# EasyEDA schematic Sheet_1.json
TITLE: Sheet_1; REV: 1.0; Date: 2025-05-11; Sheet: 1/1; Drawn By: ahmadputracahyo; Company: Your Company
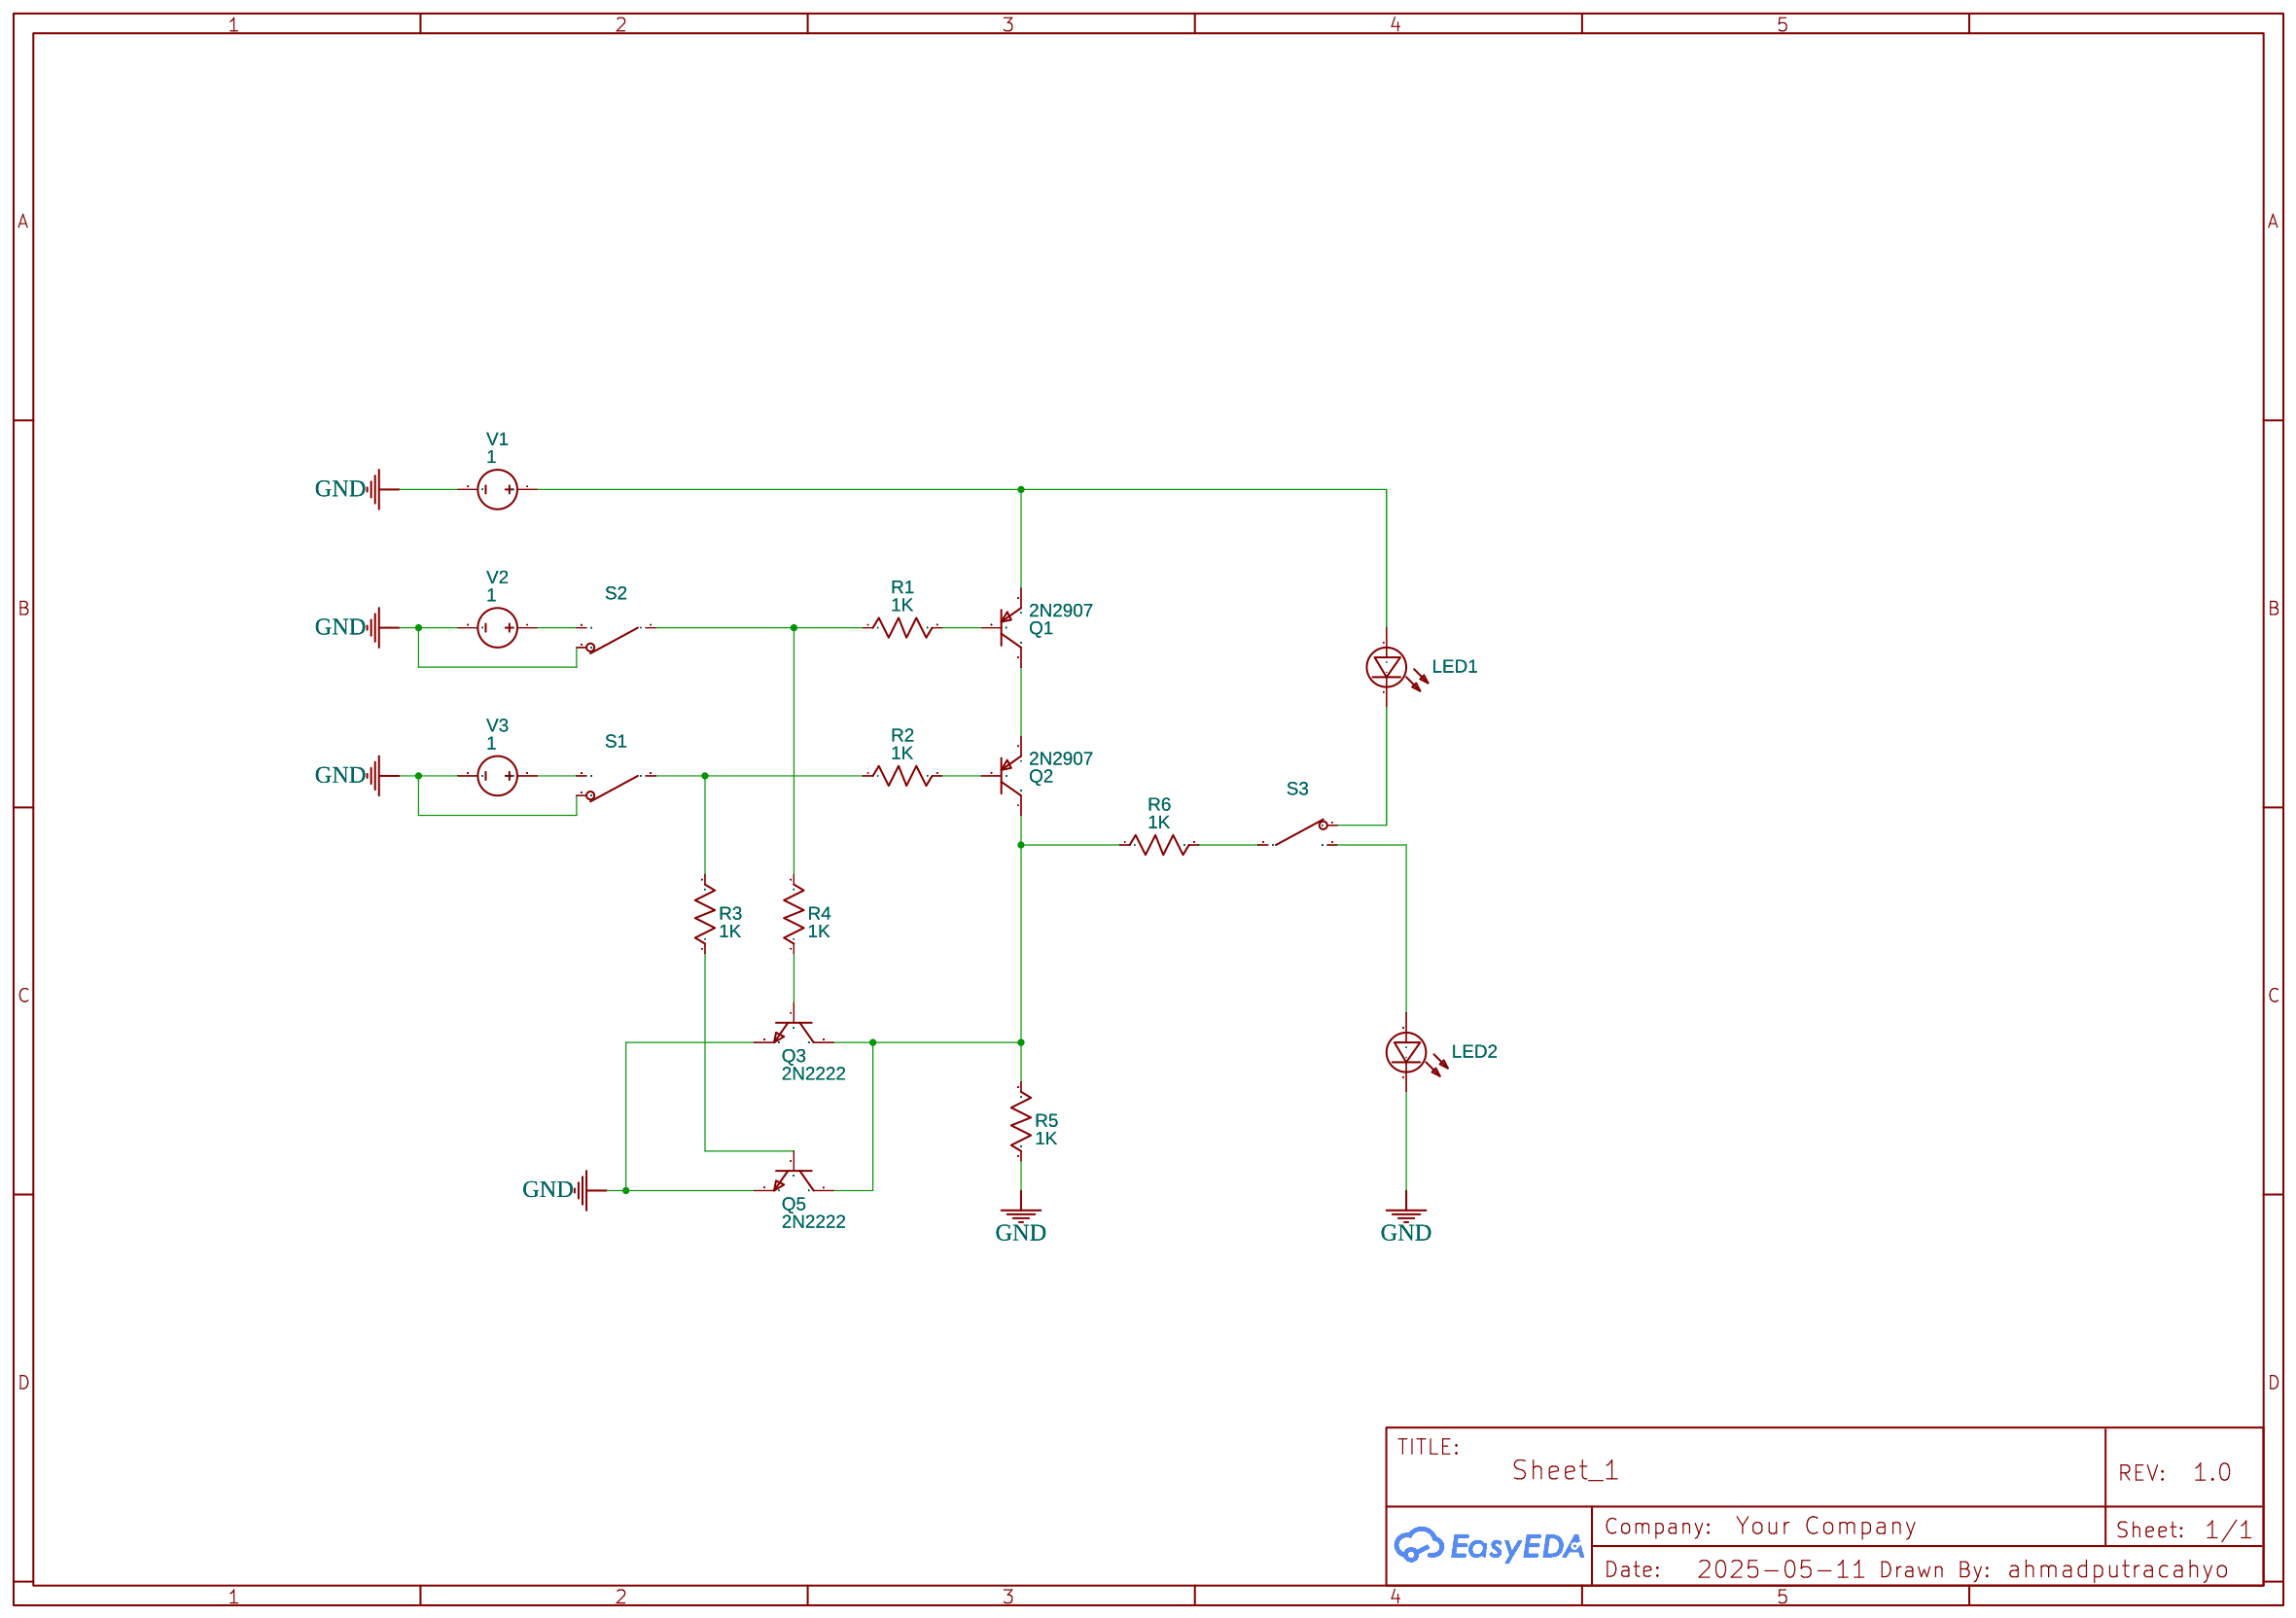
[diagram p0: schematic sheet]

## Parts
LED1  LED
LED2  LED
Q1  2N2907  [TO-92-3_L4.9-W3.7-P1.27-L]
Q2  2N2907  [TO-92-3_L4.9-W3.7-P1.27-L]
Q3  2N2222
Q5  2N2222
R1  1K  [AXIAL-0.3]
R2  1K  [AXIAL-0.3]
R3  1K  [AXIAL-0.3]
R4  1K  [AXIAL-0.3]
R5  1K  [AXIAL-0.3]
R6  1K  [AXIAL-0.3]
S1  SPDT_Open
S2  SPDT_Open
S3  SPDT_Open
V1  1  [HDR1X2]
V2  1  [HDR1X2]
V3  1  [HDR1X2]

## Library data of the parts
LED1 LED2 = LED: catid: 20; Contributor: 仿真库绘制; Color: Red; NameDisplay: 0
Q1 Q2 = 2N2907: Contributor: EasyEDA; sim: true
Q3 Q5 = 2N2222: Contributor: EasyEDA
R1-R6 = Resistor_US: Resistance: 1k; Contributor: EasyEDA; Supplier: YUJING
S1-S3 = SPDT: catid: 20; Contributor: EasyEDA; State: Open; NameDisplay: 0
V1-V3 = VDC: Contributor: EasyEDA; sim: true

## Nets
GND: LED2.2(-) Q3.2(E) Q5.2(E) R5.1 S1.2 S2.2 V1.2 V2.2 V3.2
Net-(LED1-1): LED1.1(+) Q1.3(E) V1.1
Net-(LED1-2): LED1.2(-) S3.2
Net-(LED2-1): LED2.1(+) S3.3
Net-(Q1-1): Q1.1(C) Q2.3(E)
Net-(Q1-2): Q1.2(B) R1.2
Net-(Q2-1): Q2.1(C) Q3.3(C) Q5.3(C) R5.2 R6.1
Net-(Q2-2): Q2.2(B) R2.2
Net-(Q3-1): Q3.1(B) R4.1
Net-(Q5-1): Q5.1(B) R3.1
Net-(R1-1): R1.1 R4.2 S2.1
Net-(R2-1): R2.1 R3.2 S1.1
Net-(R6-2): R6.2 S3.1
Net-(S1-3): S1.3 V3.1
Net-(S2-3): S2.3 V2.1
